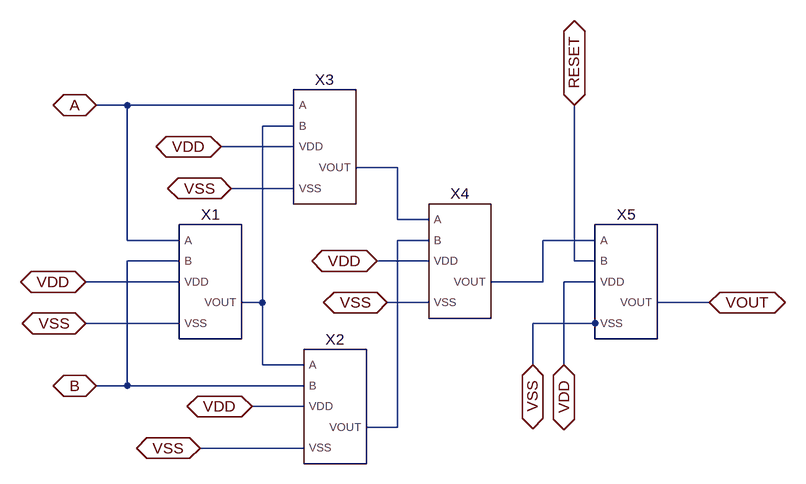
[diagram p0: schematic XNOR_reset.asc]
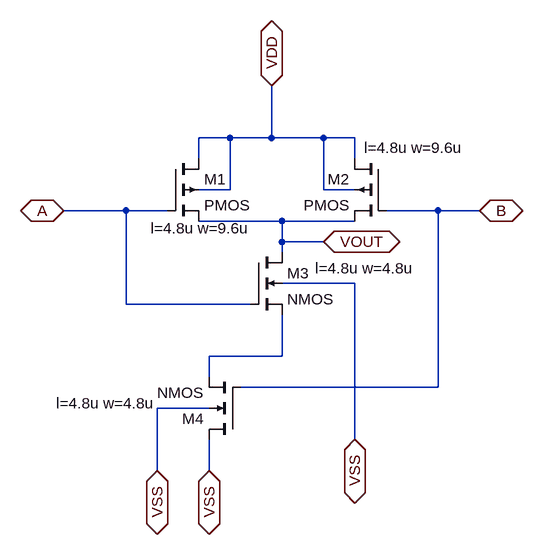
[diagram p1: sub-circuit na_nd.asc]
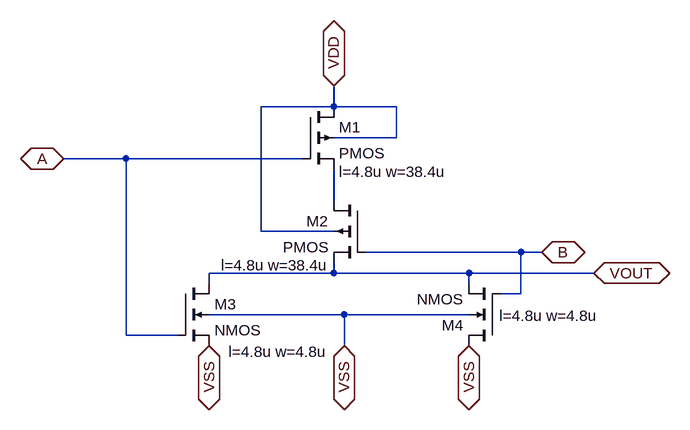
[diagram p2: sub-circuit n_or.asc]
XNOR_reset.asc, the LTspice schematic file:
Version 4
SHEET 1 880 680
WIRE -208 -224 -256 -224
WIRE 48 -224 -208 -224
WIRE 48 -192 0 -192
WIRE 48 -160 -64 -160
WIRE 208 -128 144 -128
WIRE 48 -96 -48 -96
WIRE 208 -48 208 -128
WIRE 256 -48 208 -48
WIRE -208 -16 -208 -224
WIRE -128 -16 -208 -16
WIRE 256 -16 208 -16
WIRE 512 -16 432 -16
WIRE -128 16 -208 16
WIRE 256 16 176 16
WIRE 480 16 480 -224
WIRE 512 16 480 16
WIRE -128 48 -272 48
WIRE 432 48 432 -16
WIRE 432 48 352 48
WIRE 512 48 464 48
WIRE 0 80 0 -192
WIRE 0 80 -32 80
WIRE 256 80 192 80
WIRE 688 80 608 80
WIRE -128 112 -272 112
WIRE 512 112 416 112
WIRE 512 128 512 112
WIRE 0 176 0 80
WIRE 64 176 0 176
WIRE 416 176 416 112
WIRE 464 176 464 48
WIRE -208 208 -208 16
WIRE -208 208 -256 208
WIRE 64 208 -208 208
WIRE 64 240 -16 240
WIRE 208 272 208 -16
WIRE 208 272 160 272
WIRE 64 304 -96 304
FLAG -256 -224 A
IOPIN -256 -224 BiDir
FLAG -256 208 B
IOPIN -256 208 BiDir
FLAG -272 112 VSS
IOPIN -272 112 BiDir
FLAG -272 48 VDD
IOPIN -272 48 BiDir
FLAG -64 -160 VDD
IOPIN -64 -160 BiDir
FLAG -48 -96 VSS
IOPIN -48 -96 BiDir
FLAG -96 304 VSS
IOPIN -96 304 BiDir
FLAG -16 240 VDD
IOPIN -16 240 BiDir
FLAG 688 80 VOUT
IOPIN 688 80 BiDir
FLAG 464 176 VDD
IOPIN 464 176 BiDir
FLAG 416 176 VSS
IOPIN 416 176 BiDir
FLAG 480 -224 RESET
IOPIN 480 -224 BiDir
FLAG 176 16 VDD
IOPIN 176 16 BiDir
FLAG 192 80 VSS
IOPIN 192 80 BiDir
SYMBOL NA_ND -80 48 M0
SYMATTR InstName X1
SYMBOL NA_ND 112 240 M0
SYMATTR InstName X2
SYMBOL NA_ND 96 -160 M0
SYMATTR InstName X3
SYMBOL NA_ND 304 16 M0
SYMATTR InstName X4
SYMBOL N_OR 560 48 R0
SYMATTR InstName X5

na_nd.asc, the sub-circuit schematic file:
Version 4
SHEET 1 880 680
WIRE 96 16 48 16
WIRE 160 16 160 -64
WIRE 160 16 96 16
WIRE 240 16 160 16
WIRE 288 16 240 16
WIRE 48 48 48 16
WIRE 288 48 288 16
WIRE 96 96 96 16
WIRE 96 96 48 96
WIRE 240 96 240 16
WIRE 288 96 240 96
WIRE -64 128 -160 128
WIRE 0 128 -64 128
WIRE 416 128 336 128
WIRE 480 128 416 128
WIRE 176 144 48 144
WIRE 288 144 176 144
WIRE 176 176 176 144
WIRE 240 176 176 176
WIRE 176 192 176 176
WIRE 288 240 176 240
WIRE -64 272 -64 128
WIRE 128 272 -64 272
WIRE 176 352 176 288
WIRE 176 352 64 352
WIRE 64 384 64 352
WIRE 416 400 416 128
WIRE 416 400 112 400
WIRE 64 432 -16 432
WIRE 288 480 288 240
WIRE -16 528 -16 432
WIRE 64 528 64 480
FLAG 240 176 VOUT
IOPIN 240 176 BiDir
FLAG 480 128 B
IOPIN 480 128 BiDir
FLAG 160 -64 VDD
IOPIN 160 -64 BiDir
FLAG -160 128 A
IOPIN -160 128 BiDir
FLAG -16 528 VSS
IOPIN -16 528 BiDir
FLAG 64 528 VSS
IOPIN 64 528 BiDir
FLAG 288 480 VSS
IOPIN 288 480 BiDir
SYMBOL pmos4 0 48 R0
WINDOW 123 -26 107 Left 2
SYMATTR Value2 l=4.8u w=9.6u
SYMATTR InstName M1
SYMBOL pmos4 336 48 M0
WINDOW 123 -119 -17 Left 2
SYMATTR Value2 l=4.8u w=9.6u
SYMATTR InstName M2
SYMBOL nmos4 128 192 R0
WINDOW 123 99 25 Left 2
SYMATTR Value2 l=4.8u w=4.8u
SYMATTR InstName M3
SYMBOL nmos4 112 480 R180
WINDOW 123 131 56 Left 2
SYMATTR Value2 l=4.8u w=4.8u
SYMATTR InstName M4

n_or.asc, the sub-circuit schematic file:
Version 4
SHEET 1 880 680
WIRE 192 48 192 16
WIRE 192 48 80 48
WIRE 288 48 192 48
WIRE 288 96 288 48
WIRE 288 96 192 96
WIRE -128 128 -224 128
WIRE 144 128 -128 128
WIRE 192 192 192 144
WIRE 80 240 80 48
WIRE 192 240 80 240
WIRE 480 272 240 272
WIRE 512 272 480 272
WIRE 192 304 192 288
WIRE 192 304 0 304
WIRE 400 304 192 304
WIRE 592 304 400 304
WIRE 0 320 0 304
WIRE 400 320 400 304
WIRE 480 336 480 272
WIRE 480 336 448 336
WIRE 208 368 0 368
WIRE 400 368 208 368
WIRE -128 400 -128 128
WIRE -48 400 -128 400
WIRE 208 416 208 368
FLAG 512 272 B
IOPIN 512 272 BiDir
FLAG 192 16 VDD
IOPIN 192 16 BiDir
FLAG 592 304 VOUT
IOPIN 592 304 BiDir
FLAG -224 128 A
IOPIN -224 128 BiDir
FLAG 0 416 VSS
IOPIN 0 416 BiDir
FLAG 208 416 VSS
IOPIN 208 416 BiDir
FLAG 400 416 VSS
IOPIN 400 416 BiDir
SYMBOL pmos4 144 48 R0
WINDOW 123 56 100 Left 2
SYMATTR Value2 l=4.8u w=38.4u
SYMATTR InstName M1
SYMBOL pmos4 240 192 M0
WINDOW 123 56 100 Left 2
SYMATTR Value2 l=4.8u w=38.4u
SYMATTR InstName M2
SYMBOL nmos4 -48 320 R0
WINDOW 123 78 105 Left 2
SYMATTR Value2 l=4.8u w=4.8u
SYMATTR InstName M3
SYMBOL nmos4 448 416 R180
WINDOW 123 -151 46 Left 2
SYMATTR Value2 l=4.8u w=4.8u
SYMATTR InstName M4

The netlist it stands for:
* XNOR_reset.asc
XX1 A B VDD N001 VSS na_nd
XX2 N001 B VDD N003 VSS na_nd
XX3 A N001 VDD N002 VSS na_nd
XX4 N002 N003 VDD N004 VSS na_nd
XX5 N004 RESET VDD VOUT VSS n_or

* block symbol definitions
.subckt na_nd A B VDD VOUT VSS
M1 VDD A VOUT VDD PMOS l=4.8u w=9.6u
M2 VDD B VOUT VDD PMOS l=4.8u w=9.6u
M3 VOUT A N001 VSS NMOS l=4.8u w=4.8u
M4 VSS B N001 VSS NMOS l=4.8u w=4.8u
.ends na_nd

.subckt n_or A B VDD VOUT VSS
M1 VDD A N001 VDD PMOS l=4.8u w=38.4u
M2 N001 B VOUT VDD PMOS l=4.8u w=38.4u
M3 VOUT A VSS VSS NMOS l=4.8u w=4.8u
M4 VSS B VOUT VSS NMOS l=4.8u w=4.8u
.ends n_or

.model NMOS NMOS
.model PMOS PMOS
.lib standard.mos
.backanno
.end